# EAGLE design Telex-I (EAGLE 7.5.0)
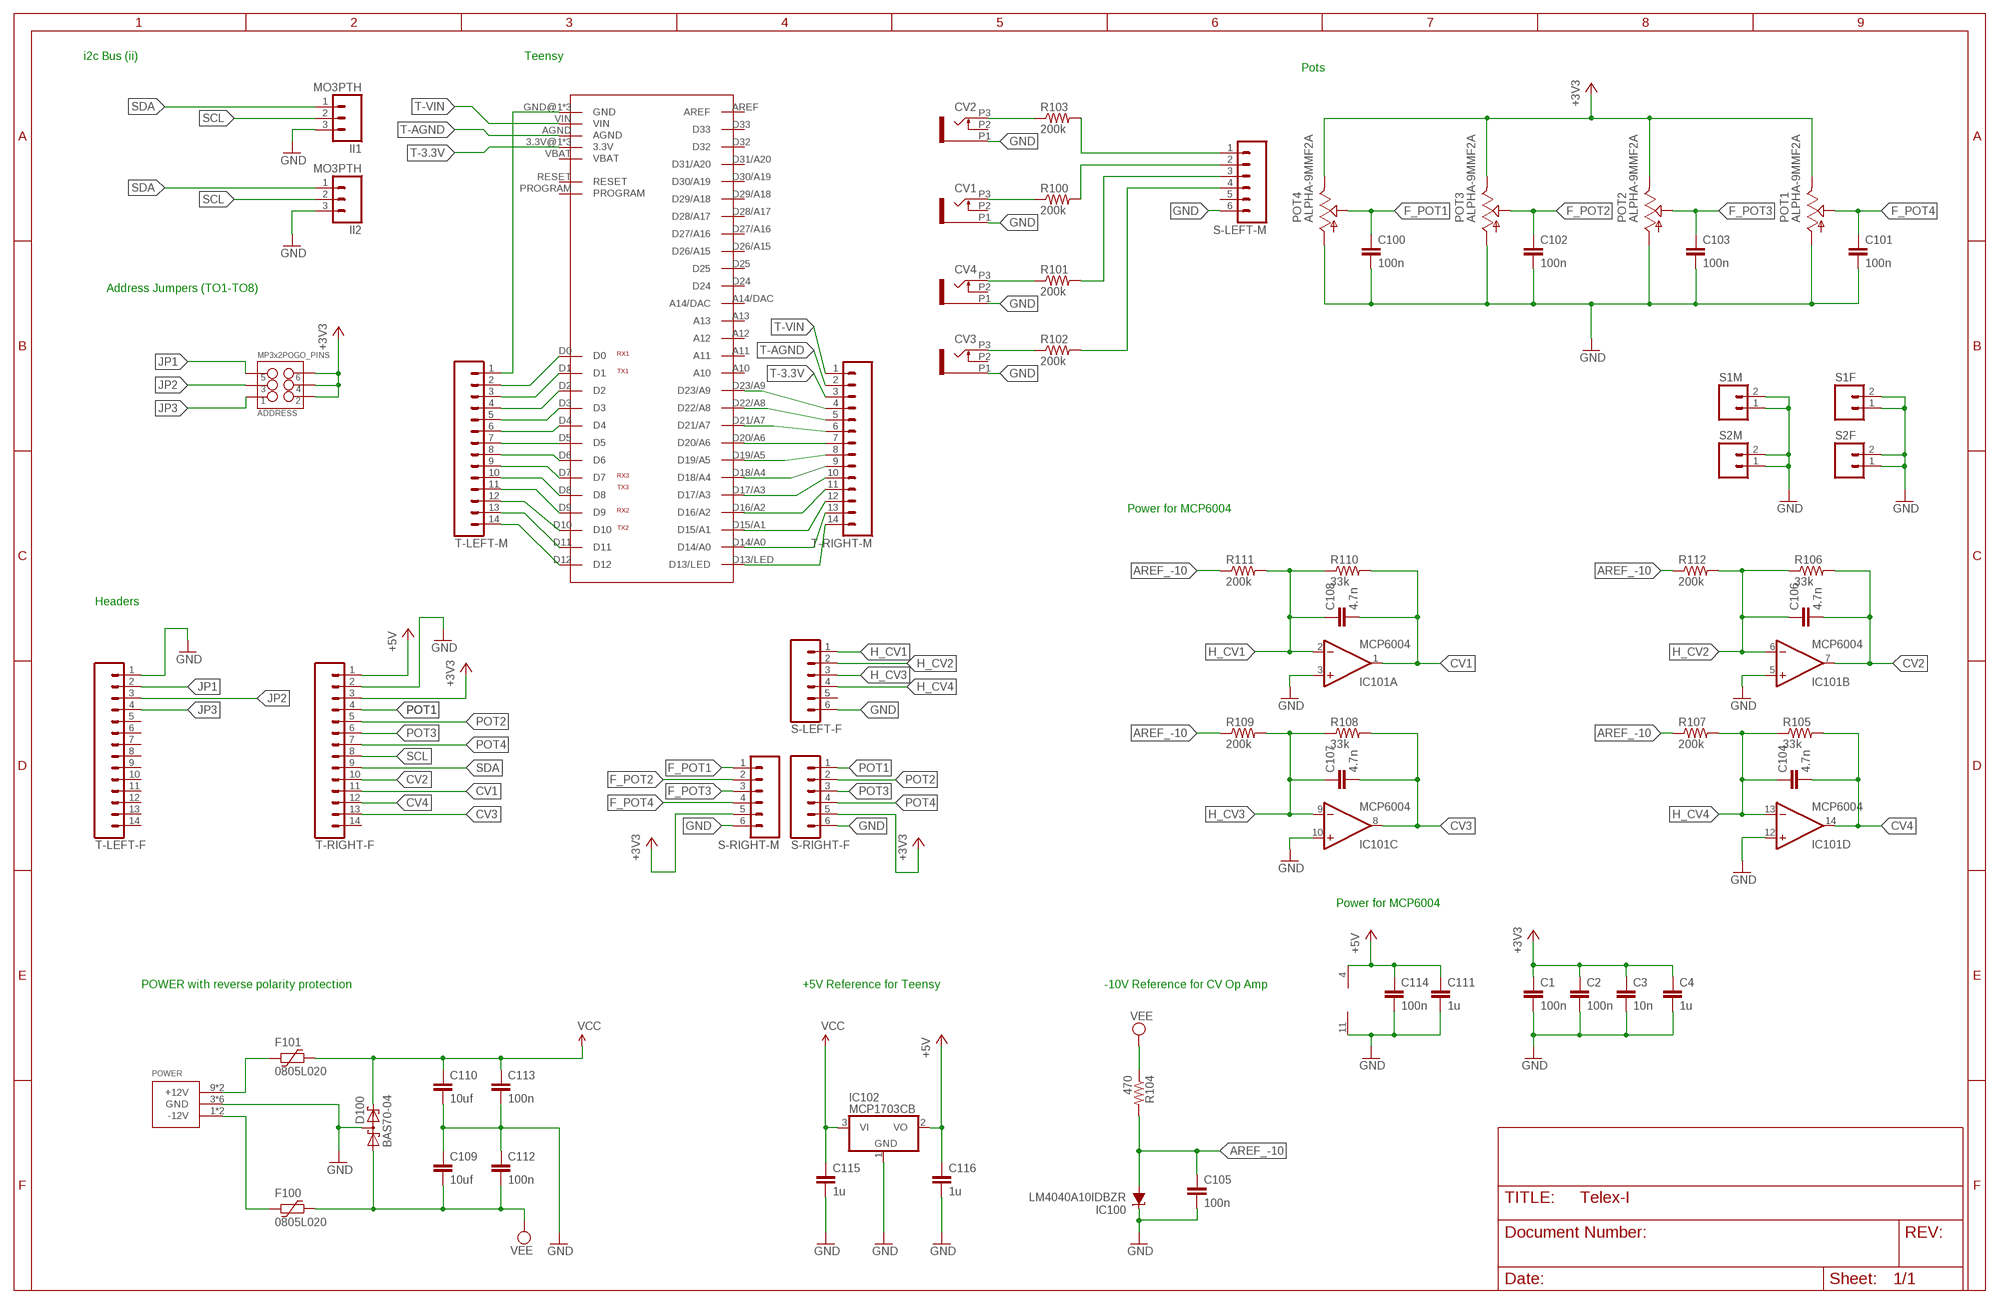
[diagram p0: schematic, sheet 1]

## Parts
ADDRESS  MP3x2POGO_PINS  M03X2POGO_PINS  [2X3_POGO]
C1  100n  CAP0603-CAP  [0603-CAP]
C2  100n  CAP0603-CAP  [0603-CAP]
C3  10n  CAP0603-CAP  [0603-CAP]
C4  1u  CAP0603-CAP  [0603-CAP]
C100  100n  CAP0603-CAP  [0603-CAP]
C101  100n  CAP0603-CAP  [0603-CAP]
C102  100n  CAP0603-CAP  [0603-CAP]
C103  100n  CAP0603-CAP  [0603-CAP]
C104  4.7n  CAP0603-CAP  [0603-CAP]
C105  100n  CAP0603-CAP  [0603-CAP]
C106  4.7n  CAP0603-CAP  [0603-CAP]
C107  4.7n  CAP0603-CAP  [0603-CAP]
C108  4.7n  CAP0603-CAP  [0603-CAP]
C109  10uf  CAP1206  [1206]
C110  10uf  CAP1206  [1206]
C111  1u  CAP0603-CAP  [0603-CAP]
C112  100n  CAP0603-CAP  [0603-CAP]
C113  100n  CAP0603-CAP  [0603-CAP]
C114  100n  CAP0603-CAP  [0603-CAP]
C115  1u  CAP0603-CAP  [0603-CAP]
C116  1u  CAP0603-CAP  [0603-CAP]
CV1  EURO_JACKS-7  [WQP_PJ_301M]
CV2  EURO_JACKS-7  [WQP_PJ_301M]
CV3  EURO_JACKS-7  [WQP_PJ_301M]
CV4  EURO_JACKS-7  [WQP_PJ_301M]
D100  BAS70-04  [SOT23]
F100  0805L020  [0805L]
F101  0805L020  [0805L]
IC100  LM4040A10IDBZR  LM4041A12DBZ  [DBZ_R-PDSO-G3]
IC101  MCP6004  TL074D  [SO14]
IC102  MCP1703CB  [SOT23]
II1  MO3PTH  M03PTH  [1X03]
II2  MO3PTH  M03PTH  [1X03]
POT1  ALPHA-9MMF2A  [EVUF]
POT2  ALPHA-9MMF2A  [EVUF]
POT3  ALPHA-9MMF2A  [EVUF]
POT4  ALPHA-9MMF2A  [EVUF]
POWER  10-Pin  POWER_SIMPLE10  [POWER_10]
R100  200k  R-US_R0603  [R0603]
R101  200k  R-US_R0603  [R0603]
R102  200k  R-US_R0603  [R0603]
R103  200k  R-US_R0603  [R0603]
R104  470  R-US_R0603  [R0603]
R105  33k  R-US_R0603  [R0603]
R106  33k  R-US_R0603  [R0603]
R107  200k  R-US_R0603  [R0603]
R108  33k  R-US_R0603  [R0603]
R109  200k  R-US_R0603  [R0603]
R110  33k  R-US_R0603  [R0603]
R111  200k  R-US_R0603  [R0603]
R112  200k  R-US_R0603  [R0603]
S1F  M02PTH  [1X02]
S1M  M02PTH  [1X02]
S2F  M02PTH  [1X02]
S2M  M02PTH  [1X02]
S-LEFT-F  M06SILK_FEMALE_PTH  [1X06]
S-LEFT-M  M06SILK_FEMALE_PTH  [1X06]
S-RIGHT-F  M06SILK_FEMALE_PTH  [1X06]
S-RIGHT-M  M06SILK_FEMALE_PTH  [1X06]
T-LEFT-F  M14  [1X14]
T-LEFT-M  M14  [1X14]
T-RIGHT-F  M14  [1X14]
T-RIGHT-M  M14  [1X14]
U$1  TEENSY3.1_ALL  [TEENSY3.1_ALL]

## Nets
+3V3: ADDRESS.P$2 ADDRESS.P$4 ADDRESS.P$6 C1.1 C2.1 C3.1 C4.1 POT1.3(E) POT2.3(E) POT3.3(E) POT4.3(E) S-RIGHT-F.5 S-RIGHT-M.5 T-RIGHT-F.3
+5V: C111.1 C114.1 C116.1 IC101.4(P:V+) IC102.2(VO) T-RIGHT-F.1
AREF_-10: C105.1 IC100.2(A) R104.2 R107.1 R109.1 R111.1 R112.1
CV1: C108.2 IC101.1(A:OUT) R110.2 T-RIGHT-F.11
CV2: C106.2 IC101.7(B:OUT) R106.2 T-RIGHT-F.10
CV3: C107.2 IC101.8(C:OUT) R108.2 T-RIGHT-F.13
CV4: C104.2 IC101.14(D:OUT) R105.2 T-RIGHT-F.12
F_POT1: C100.1 POT4.2(S) S-RIGHT-M.1
F_POT2: C102.1 POT3.2(S) S-RIGHT-M.2
F_POT3: C103.1 POT2.2(S) S-RIGHT-M.3
F_POT4: C101.1 POT1.2(S) S-RIGHT-M.4
GND: C1.2 C2.2 C3.2 C4.2 C100.2 C101.2 C102.2 C103.2 C105.2 C109.1 C110.2 C111.2 C112.1 C113.2 C114.2 C115.2 C116.2 CV1.P1 CV2.P1 CV3.P1 CV4.P1 D100.3(C1A2) IC100.1(C) IC101.3(A:+IN) IC101.5(B:+IN) IC101.10(C:+IN) IC101.11(P:V-) IC101.12(D:+IN) IC102.1(GND) II1.3 II2.3 POT1.1(A) POT2.1(A) POT3.1(A) POT4.1(A) POWER.3(GND) POWER.4(GND) POWER.5(GND) POWER.6(GND) POWER.7(GND) POWER.8(GND) S1F.1 S1F.2 S1M.1 S1M.2 S2F.1 S2F.2 S2M.1 S2M.2 S-LEFT-F.6 S-LEFT-M.6 S-RIGHT-F.6 S-RIGHT-M.6 T-LEFT-F.1 T-RIGHT-F.2
H_CV1: C108.1 IC101.2(A:-IN) R110.1 R111.2 S-LEFT-F.1
H_CV2: C106.1 IC101.6(B:-IN) R106.1 R112.2 S-LEFT-F.2
H_CV3: C107.1 IC101.9(C:-IN) R108.1 R109.2 S-LEFT-F.3
H_CV4: C104.1 IC101.13(D:-IN) R105.1 R107.2 S-LEFT-F.4
JP1: ADDRESS.P$5 T-LEFT-F.2
JP2: ADDRESS.P$3 T-LEFT-F.3
JP3: ADDRESS.P$1 T-LEFT-F.4
N$1: T-RIGHT-M.14 U$1.D13/LED
N$2: F101.2 POWER.9(+12V) POWER.10(+12V)
N$3: F100.2 POWER.1(-12V) POWER.2(-12V)
N$5: CV2.P3 R103.1
N$6: CV1.P3 R100.1
N$8: R103.2 S-LEFT-M.1
N$9: R100.2 S-LEFT-M.2
N$10: R101.2 S-LEFT-M.3
N$11: CV4.P3 R101.1
N$13: R102.2 S-LEFT-M.4
N$16: T-LEFT-M.2 U$1.D0
N$17: CV3.P3 R102.1
N$48: T-LEFT-M.3 U$1.D1
N$49: T-LEFT-M.4 U$1.D2
N$50: T-LEFT-M.5 U$1.D3
N$51: T-LEFT-M.6 U$1.D4
N$52: T-LEFT-M.7 U$1.D5
N$53: T-LEFT-M.8 U$1.D6
N$54: T-LEFT-M.9 U$1.D7
N$55: T-LEFT-M.12 U$1.D10
N$56: T-LEFT-M.13 U$1.D11
N$57: T-LEFT-M.1 U$1.GND@1(GND) U$1.GND@2(GND) U$1.GND@3(GND)
N$58: T-LEFT-M.10 U$1.D8
N$59: T-LEFT-M.11 U$1.D9
N$60: T-LEFT-M.14 U$1.D12
N$61: T-RIGHT-M.13 U$1.D14/A0
N$62: T-RIGHT-M.12
N$63: T-RIGHT-M.11
N$64: T-RIGHT-M.10
N$65: T-RIGHT-M.9
N$66: T-RIGHT-M.8 U$1.D19/A5
N$67: T-RIGHT-M.7
N$68: T-RIGHT-M.6
N$69: T-RIGHT-M.5 U$1.D22/A8
N$70: T-RIGHT-M.4 U$1.D23/A9
POT1: S-RIGHT-F.1 T-RIGHT-F.4
POT2: S-RIGHT-F.2 T-RIGHT-F.5
POT3: S-RIGHT-F.3 T-RIGHT-F.6
POT4: S-RIGHT-F.4 T-RIGHT-F.7
SCL: II1.2 II2.2 T-RIGHT-F.8
SDA: II1.1 II2.1 T-RIGHT-F.9
T-3.3V: T-RIGHT-M.3 U$1.3.3V@1(3.3V) U$1.3.3V@2(3.3V) U$1.3.3V@3(3.3V)
T-AGND: T-RIGHT-M.2 U$1.AGND
T-VIN: T-RIGHT-M.1 U$1.VIN
VCC: C110.1 C113.1 C115.1 D100.2(C2) F101.1 IC102.3(VI)
VEE: C109.2 C112.2 D100.1(A1) F100.1 R104.1
Unconnected: CV1.P2 CV2.P2 CV3.P2 CV4.P2 S-LEFT-F.5 S-LEFT-M.5 T-LEFT-F.5 T-LEFT-F.6 T-LEFT-F.7 T-LEFT-F.8 T-LEFT-F.9 T-LEFT-F.10 T-LEFT-F.11 T-LEFT-F.12 T-LEFT-F.13 T-LEFT-F.14 T-RIGHT-F.14 U$1.A10 U$1.A11 U$1.A12 U$1.A13 U$1.A14/DAC U$1.AREF U$1.D15/A1 U$1.D16/A2 U$1.D17/A3 U$1.D18/A4 U$1.D20/A6 U$1.D21/A7 U$1.D24 U$1.D25 U$1.D26/A15 U$1.D27/A16 U$1.D28/A17 U$1.D29/A18 U$1.D30/A19 U$1.D31/A20 U$1.D32 U$1.D33 U$1.PROGRAM U$1.RESET U$1.VBAT

## Notes on the sheet
- i2c Bus (ii) | Teensy
- Pots
- Address Jumpers (TO1-TO8)
- Power for MCP6004
- Headers
- Power for MCP6004
- POWER with reverse polarity protection | +5V Reference for Teensy | -10V Reference for CV Op Amp

## Library data of the parts
ADDRESS = SparkFun-Connectors:M03X2: 2x3 .1" header. Shrouded, with keying- CONN-10681 SMT- CONN-11415 Pogo pins- HW-11044; PROD_ID: HW-11044
C1-C4 C100-C116 = SparkFun-Passives:CAP: Capacitor Standard 0603 ceramic capacitor, and 0.1" leaded capacitor.
CV1-CV4 = tsyklon-labs:EURO_JACKS
D100 = diode:BAS70-04: Silicon Schottky Diodes General-purpose diode for high-speed switching
F100 F101 = polyfuse-smd_10:?: Polyfuse Resettable PTC Source: http://www.littelfuse.com/products/resettable-ptcs.aspx; MF: Littelfuse; MPN: 0805L020; OC_FARNELL: 1832107; OC_NEWARK: 05M2226
IC100 = texas:LM4041: PRECISION MICROPOWER SHUNT VOLTAGE REFERENCE Source: http://focus.ti.com/lit/ds/slcs146e/slcs146e.pdf; MPN: LM4041A12IDBZR; OC_FARNELL: 1407949; OC_NEWARK: 58K5875
IC101 = linear:TL074: OP AMP
IC102 = linear:MCP1703: 250 mA, 16V, Low Quiescent Current LDO Regulator Source: http://ww1.microchip.com/downloads/en/DeviceDoc/22049b.pdf
II1 II2 = SparkFun-Connectors:M03: Header 3 Standard 3-pin 0.1" header. Use with straight break away headers (SKU : PRT-00116), right angle break away headers (PRT-00553), swiss pins (PRT-00743), machine pins (PRT-00117), and female headers (PRT-00115). Molex polarized connector foot print use with SKU : PRT-08232 with associated crimp pins and housings.
POT1-POT4 = TomW:ALPHA-9MM: 9 mm Square Rotary Potentiometers Source: Panasonic
POWER = eurorack:POWER_SIMPLE
R100-R112 = adafruit:R-US_: RESISTOR, American symbol
S1F S1M S2F S2M = SparkFun-Connectors:M02: Standard 2-pin 0.1" header. Use with - straight break away headers ( PRT-00116) - right angle break away headers (PRT-00553) - swiss pins (PRT-00743) - machine pins (PRT-00117) - female headers (PRT-00115) Molex polarized connector foot print use with: PRT-08233 with associated crimp pins and housings. 2.54_SCREWTERM for use with PRT-10571. 3.5mm Screw Terminal footprints for PRT-08084 5mm Screw Terminal footprints for use with PRT-08432
S-LEFT-F S-LEFT-M S-RIGHT-F S-RIGHT-M = SparkFun-Connectors:M06: Header 6 Standard 6-pin 0.1" header. Use with straight break away headers (SKU : PRT-00116), right angle break away headers (PRT-00553), swiss pins (PRT-00743), machine pins (PRT-00117), and female headers (PRT-00115). Molex polarized connector foot print use with SKU : PRT-08094 with associated crimp pins and housings. NOTES ON THE VARIANTS LOCK and LOCK_LONGPADS... This footprint was designed to help hold the alignment of a through-hole component (i.e. 6-pin header) while soldering it into place. You may notice that each hole has been shifted either up or down by 0.005 of an inch from it's more standard position (which is a perfectly straight line). This slight alteration caused the pins (the squares in the middle) to touch the edges of the holes. Because they are alternating, it causes a "brace" to hold the component in place. 0.005 has proven to be the perfect amount of "off-center" position when using our standard breakaway headers. Although looks a little odd when you look at the bare footprint, once you have a header in there, the alteration is very hard to notice. Also,if you push a header all the way into place, it is covered up entirely on the bottom side. This idea of altering the position of holes to aid alignment will be further integrated into the Sparkfun Library for other footprints. It can help hold any component with 3 or more connection pins.; PROD_ID: CONN-08437
T-LEFT-F T-LEFT-M T-RIGHT-F T-RIGHT-M = SparkFun-Connectors:M14: Header 14 Standard 14-pin 0.1" header. Use with straight break away headers (SKU : PRT-00116), right angle break away headers (PRT-00553), swiss pins (PRT-00743), machine pins (PRT-00117), and female headers (PRT-00115).
U$1 = Teensy3.1:TEENSY3.1_ALL

## Net classes
0 default: width 0.254 mm, drill 0.508 mm, clearance 0.203 mm

## Board
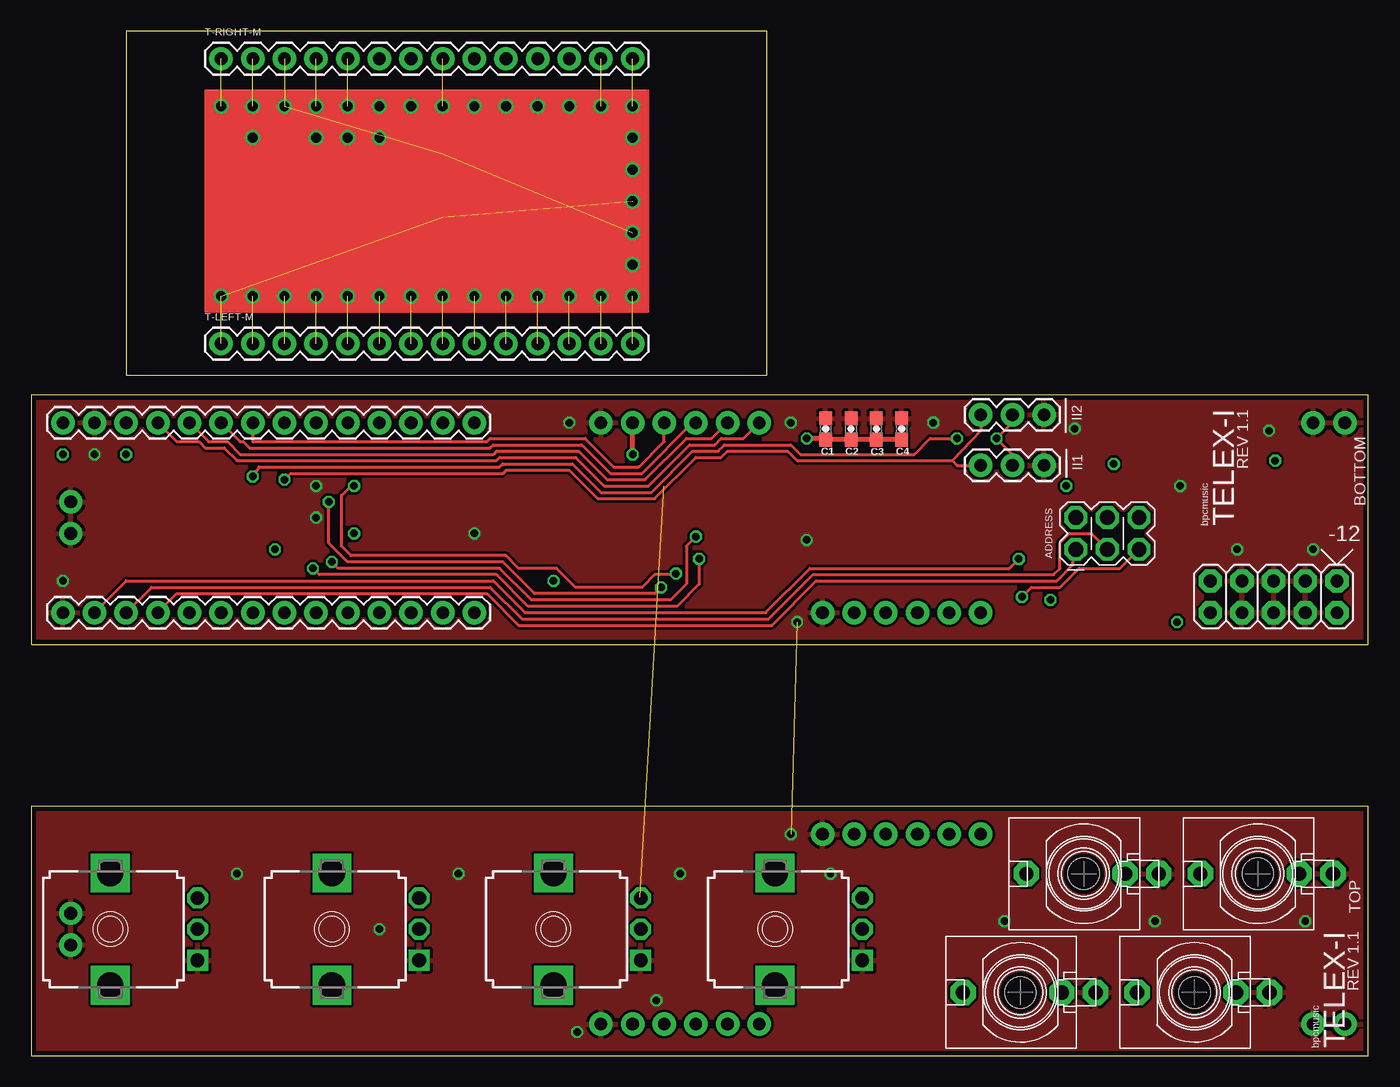
[diagram p1: board, top side]
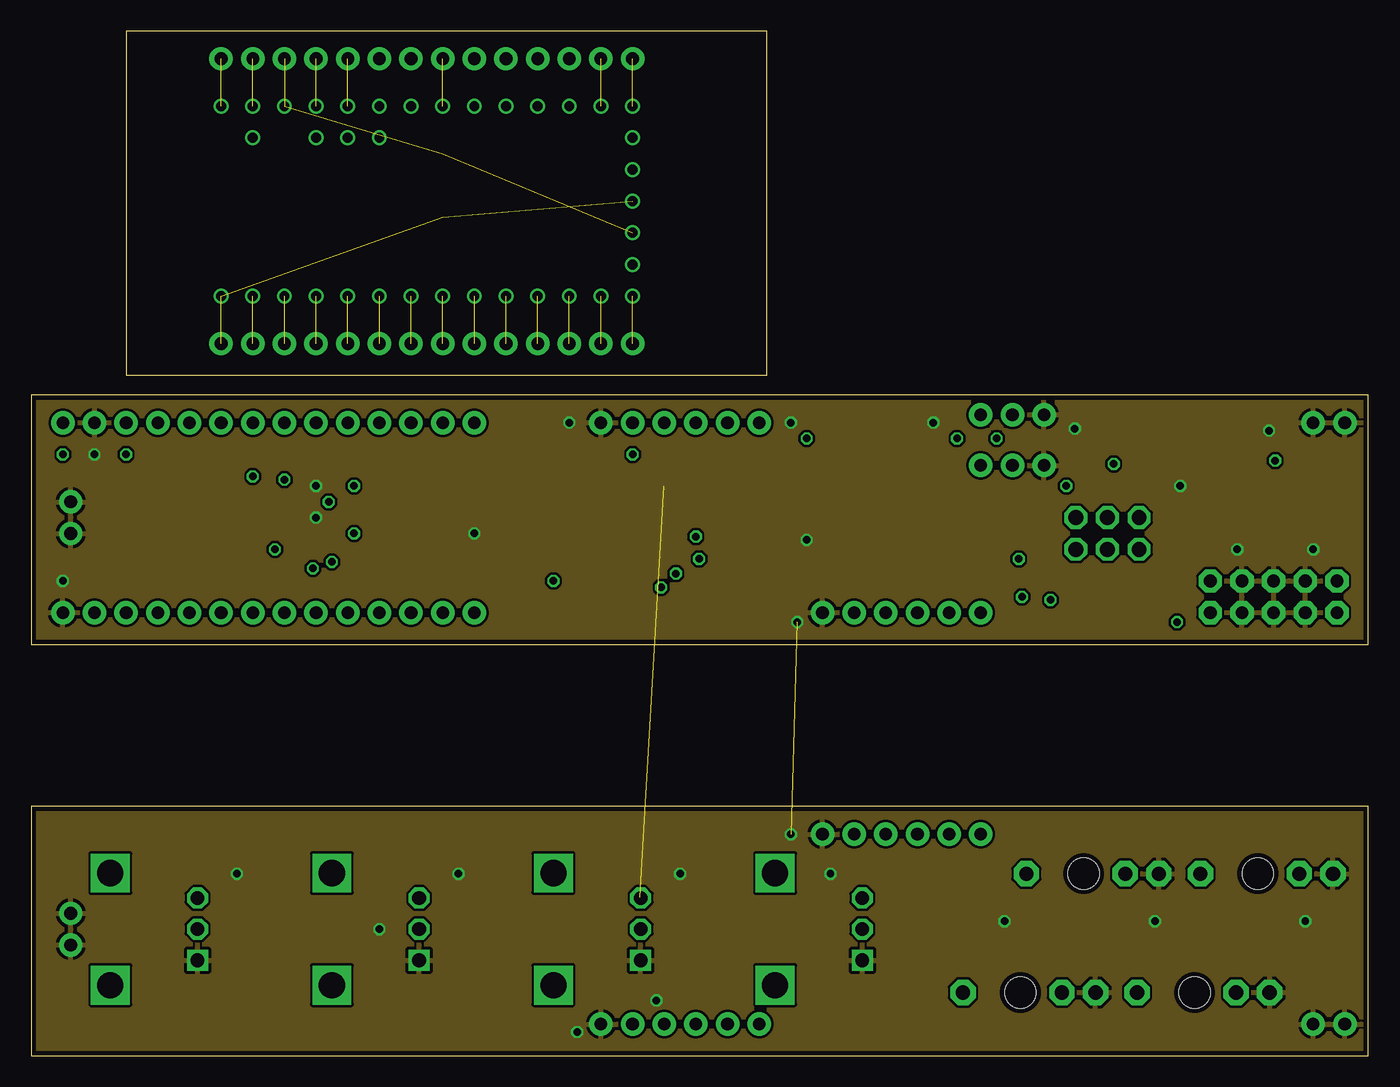
[diagram p2: board, inner layer Route2]
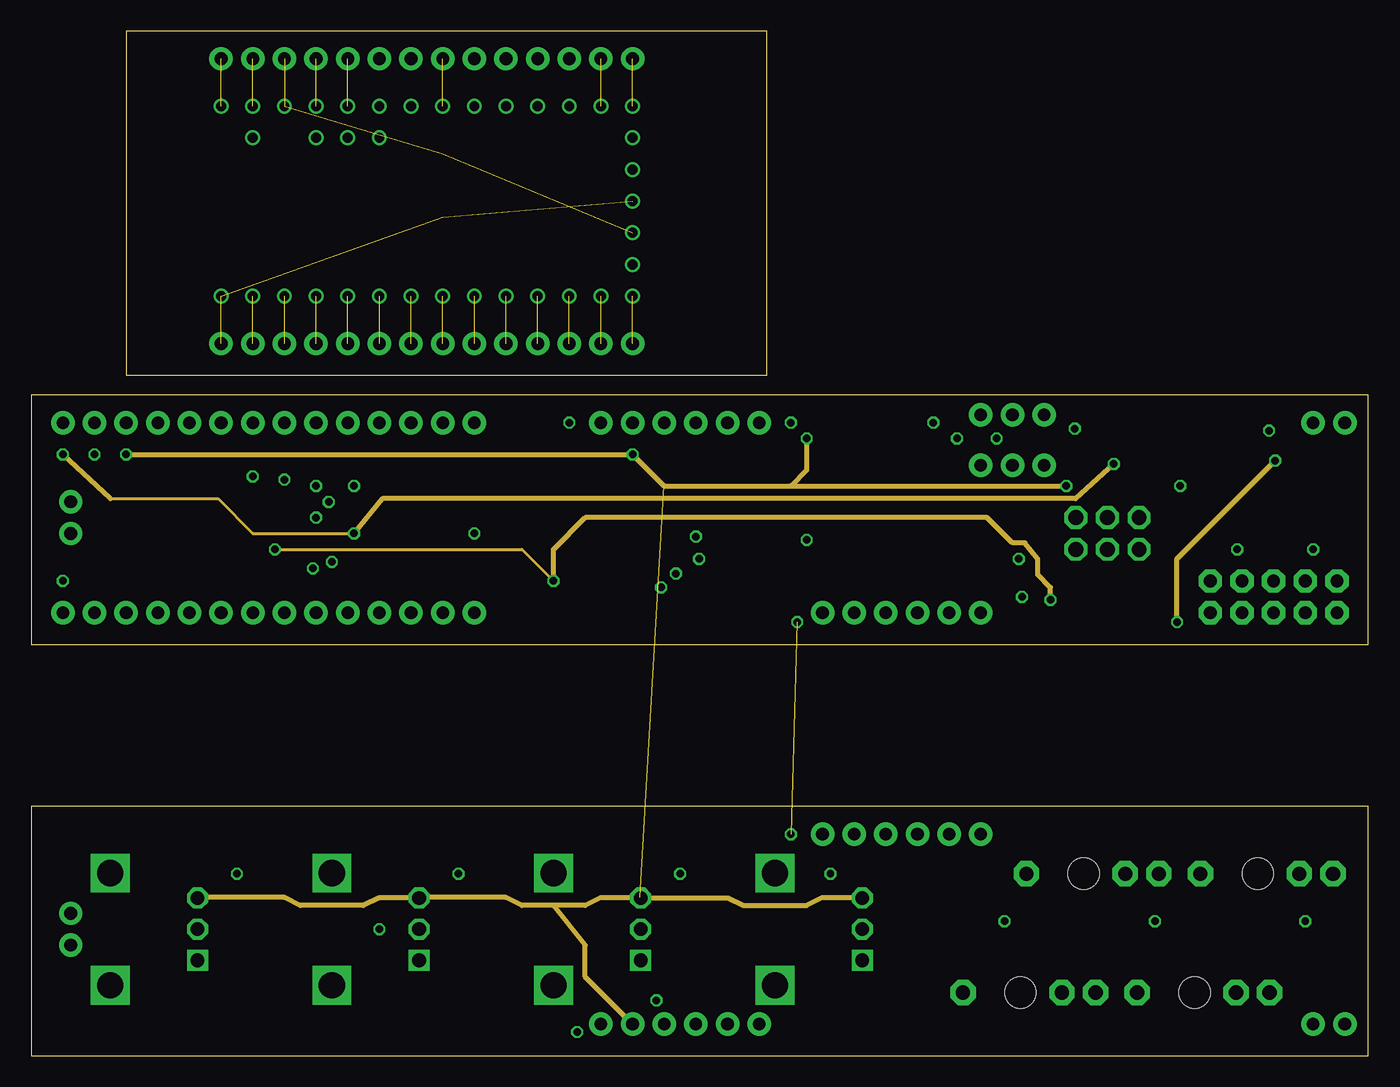
[diagram p3: board, inner layer Route15]
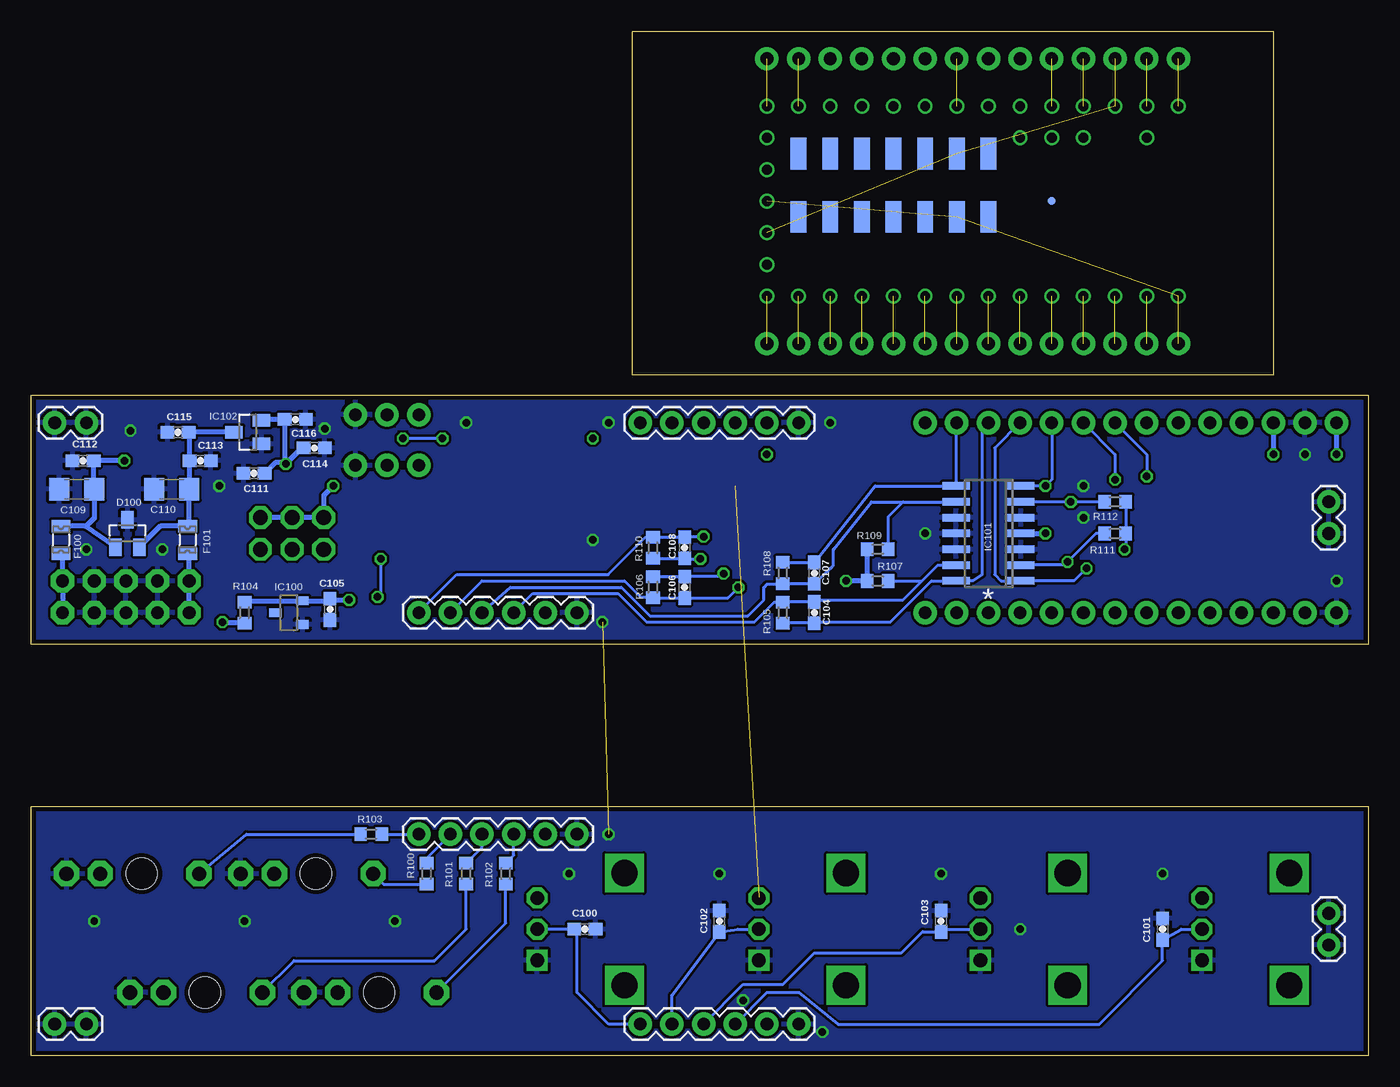
[diagram p4: board, bottom side, seen from below]

Size 107.3 x 82.22 mm. Coordinates in mm from the lower left corner, seen from the top.
Outline: 0,0 107.3,0 107.3,19.99 0,19.99 0,0
Outline: 107.3,53.01 0,53.01 0,33.02 107.3,33.02 107.3,53.01
Outline: 59.03,82.22 7.62,82.22 7.62,54.61 59.03,54.61 59.03,82.22
Copper layers (1*16): Top 0.0356mm / dielectric 1.5011mm / Bottom 0.0356mm
Design rules "LaenPCBOrder": minimum track width 6mil, minimum drill 13mil, track to track 6mil, track to pad 6mil, pad to pad 6mil, via to via 6mil, smd to smd 6mil, copper to edge 15mil, drill to drill 6mil, minimum pad ring 7mil, minimum via ring 7mil, stop-mask expansion 3mil, vias tented up to drill 0mil, thermal gap 10mil

### Footprints (pad centres in the part's own frame; a part is rotated, then mirrored left to right if it is on the bottom)
2X3_POGO = drill 1.2 pad 1.829 octagon: P$1 0,0; P$2 0,2.54; P$3 2.54,0; P$4 2.54,2.54; P$5 5.08,0; P$6 5.08,2.54
0603-CAP = smd 1.1 x 1: 1 -0.85,0; 2 0.85,0
1206 = smd 1.6 x 1.8: 1 -1.4,0; 2 1.4,0
WQP_PJ_301M = drill 1.143 pad 2.032 octagon: P1 0,-6.032; P2 0,-3.334; P3 0,4.604 | hole 2.5: 0,0
SOT23 = smd 1 x 1.4: 1 -0.95,-1.1; 2 0.95,-1.1; 3 0,1.1
0805L = smd 1 x 1.5: 1 -1.1,0; 2 1.1,0
DBZ_R-PDSO-G3 = smd 0.7 x 1: 1 -0.95,-1.1; 2 0.95,-1.1; 3 0,1.1
SO14 = smd 0.6 x 2.2: 1 -3.81,-2.6; 2 -2.54,-2.6; 3 -1.27,-2.6; 4 0,-2.6; 5 1.27,-2.6; 6 2.54,-2.6; 7 3.81,-2.6; 8 3.81,2.6; 9 2.54,2.6; 10 1.27,2.6; 11 0,2.6; 12 -1.27,2.6; 13 -2.54,2.6; 14 -3.81,2.6
1X03 = drill 1.016 pad 1.88: 1 0,0; 2 2.54,0; 3 5.08,0
EVUF = drill 1.1 pad 1.676 square: 1 -2.5,-7 | drill 1.1 pad 1.676 octagon: 2 0,-7; 3 2.5,-7 | drill 2.1 pad 2.8 square: M1 4.5,0; M2 -4.5,0
POWER_10 = drill 1.016 pad 1.88 octagon: 1 -5.08,-1.27; 2 -5.08,1.27; 3 -2.54,-1.27; 4 -2.54,1.27; 5 0,-1.27; 6 0,1.27; 7 2.54,-1.27; 8 2.54,1.27; 9 5.08,-1.27; 10 5.08,1.27
R0603 = smd 1 x 1.1: 1 -0.85,0; 2 0.85,0
1X02 = drill 1.016 pad 1.88: 1 0,0; 2 2.54,0
1X06 = drill 1.016 pad 1.88: 1 0,0; 2 2.54,0; 3 5.08,0; 4 7.62,0; 5 10.16,0; 6 12.7,0
1X14 = drill 1.016 pad 1.88: 1 0,0; 2 2.54,0; 3 5.08,0; 4 7.62,0; 5 10.16,0; 6 12.7,0; 7 15.24,0; 8 17.78,0; 9 20.32,0; 10 22.86,0; 11 25.4,0; 12 27.94,0; 13 30.48,0; 14 33.02,0
TEENSY3.1_ALL = drill 0.8: 3.3V@1 2.54,5.08; 3.3V@2 -7.62,-22.86; A10 0,0; A11 0,-2.54; A14/DAC 0,-22.86; AGND 2.54,7.62; AREF 0,2.54; D0 -12.7,7.62; D1 -12.7,5.08; D2 -12.7,2.54; D3 -12.7,0; D4 -12.7,-2.54; D5 -12.7,-5.08; D6 -12.7,-7.62; D7 -12.7,-10.16; D8 -12.7,-12.7; D9 -12.7,-15.24; D10 -12.7,-17.78; D11 -12.7,-20.32; D12 -12.7,-22.86; D13/LED 2.54,-22.86; D14/A0 2.54,-20.32; D15/A1 2.54,-17.78; D16/A2 2.54,-15.24; D17/A3 2.54,-12.7; D18/A4 2.54,-10.16; D19/A5 2.54,-7.62; D20/A6 2.54,-5.08; D21/A7 2.54,-2.54; D22/A8 2.54,0; D23/A9 2.54,2.54; GND@1 -12.7,10.16; GND@2 -5.08,-22.86; PROGRAM -2.54,-22.86; VBAT -10.16,-22.86; VIN 2.54,10.16; VUSB 0,7.62 | smd 2.54 x 1.27 bottom: 3.3V@3 -1.27,-7.62; A12 -6.35,-5.08; A13 -1.27,-5.08; D24 -6.35,-10.16; D25 -6.35,-12.7; D26/A15 -6.35,-15.24; D27/A16 -6.35,-17.78; D28/A17 -6.35,-20.32; D29/A18 -1.27,-20.32; D30/A19 -1.27,-17.78; D31/A20 -1.27,-15.24; D32 -1.27,-12.7; D33 -1.27,-10.16; GND@3 -6.35,-7.62 | smd 0.635 x 0.635 bottom: RESET -5.08,0

### Placement (x,y rotation side)
ADDRESS  83.82,40.64 0 top
C1  63.75,50.29 90 top
C2  65.79,50.29 90 top
C3  67.82,50.29 90 top
C4  69.85,50.29 90 top
C100  62.87,10.16 0 bottom
C101  16.51,10.16 90 bottom
C102  52.07,10.79 90 bottom
C103  34.29,10.79 90 bottom
C104  44.45,35.56 270 bottom
C105  83.31,35.81 270 bottom
C106  54.86,37.59 90 bottom
C107  44.45,38.73 90 bottom
C108  54.86,40.77 270 bottom
C109  103.63,45.47 0 bottom
C110  96.01,45.47 180 bottom
C111  89.41,46.74 180 bottom
C112  103.12,47.75 0 bottom
C113  93.73,47.75 0 bottom
C114  84.58,48.77 0 bottom
C115  95.5,50.04 180 bottom
C116  86.11,51.05 0 bottom
CV1  84.45,14.61 90 top
CV2  98.42,14.61 90 top
CV3  79.38,5.08 90 top
CV4  93.34,5.08 90 top
D100  99.57,41.91 0 bottom
F100  104.9,41.4 270 bottom
F101  94.74,41.4 270 bottom
IC100  86.61,35.56 90 bottom
IC101  30.48,41.91 90 bottom
IC102  89.92,50.04 90 bottom
II1  76.2,47.37 0 top
II2  76.2,51.44 0 top
POT1  6.35,10.16 90 top
POT2  24.13,10.16 90 top
POT3  41.91,10.16 90 top
POT4  59.69,10.16 90 top
POWER  99.69,36.83 180 top
R100  75.56,14.61 90 bottom
R101  72.39,14.61 90 bottom
R102  69.22,14.61 90 bottom
R103  80.01,17.78 0 bottom
R104  90.17,35.56 90 bottom
R105  46.99,35.56 270 bottom
R106  57.4,37.59 90 bottom
R107  39.37,38.1 0 bottom
R108  46.99,38.73 90 bottom
R109  39.37,40.64 0 bottom
R110  57.4,40.77 270 bottom
R111  20.32,41.91 180 bottom
R112  20.32,44.45 180 bottom
S1F  3.17,8.89 90 bottom
S1M  3.17,41.91 90 bottom
S2F  105.41,2.54 0 bottom
S2M  105.41,50.8 0 bottom
S-LEFT-F  76.2,35.56 0 bottom
S-LEFT-M  76.2,17.78 0 bottom
S-RIGHT-F  58.42,50.8 0 bottom
S-RIGHT-M  58.42,2.54 0 bottom
T-LEFT-F  2.54,35.56 0 top
T-LEFT-M  15.24,57.15 0 top
T-RIGHT-F  2.54,50.8 0 top
T-RIGHT-M  15.24,80.01 0 top
U$1  25.4,73.66 90 top

### Tracks (layer width: path | path; a pad name or v marks a point on that pad's centre or on a via)
+3V3  (via drill 0.6)  (1 unrouted)
  Top 0.406: v48.26,48.26 S-RIGHT-F.5 | C4.1 C3.1 C2.1 C1.1 63.41,49.53 v62.23,49.53
  Route15 0.406: S-RIGHT-M.5 44.45,6.35 44.45,8.89 41.91,12.06 | 41.91,12.06 44.45,12.06 45.72,12.7 48.87,12.7 POT3.3 55.92,12.66 57.15,12.06 62.23,12.06 63.5,12.7 66.65,12.7 POT4.3 | 41.91,12.06 39.37,12.06 38.1,12.7 31.17,12.7 POT2.3 27.9,12.66 26.67,12.06 21.59,12.06 20.32,12.7 13.39,12.7 POT1.3 | v7.62,48.26 v48.26,48.26 50.8,45.72 60.96,45.72 | 60.96,45.72 v83.06,45.72 | v62.23,49.53 62.23,46.99 60.96,45.72
  Bottom 0.406: T-RIGHT-F.3 v7.62,48.26 | v83.06,45.72 83.82,44.96 ADDRESS.P$2 ADDRESS.P$4 ADDRESS.P$6
+5V  (via drill 0.6)
  Route15 0.254: 6.35,44.7 14.99,44.7 17.78,41.91 v25.91,41.91
  Route15 0.406: v86.87,47.5 83.82,44.7 28.19,44.7 v25.91,41.91 | 6.35,44.7 v2.54,48.26
  Bottom 0.406: IC102.2 88.75,51.05 C116.1 86.96,47.59 | 86.96,47.59 v86.87,47.5 85.6,48.77 C114.1 | v2.54,48.26 T-RIGHT-F.1 | 86.96,47.59 87.71,47.59 C111.1 | IC101.4 v25.91,41.91
AREF_-10  (via drill 0.6)
  Route15 0.254: v19.56,40.64 39.37,40.64 v41.91,38.1
  Route15 0.406: v81.79,36.58 81.79,37.59 80.77,38.61 80.77,39.88 79.76,41.15 78.74,41.15 76.71,43.18 44.45,43.18 41.91,40.64 v41.91,38.1
  Bottom 0.254: R112.1 R111.1 19.47,40.73 v19.56,40.64
  Bottom 0.406: R104.2 90.07,36.51 IC100.2 83.47,36.51 C105.1 83.06,36.58 v81.79,36.58 | v41.91,38.1 R107.1 R109.1
CV1  (via drill 0.6)
  Top 0.254: v53.59,39.88 53.59,37.85 51.82,36.07 39.88,36.07 37.34,38.61 23.11,38.61 v22.61,39.12
  Bottom 0.254: R110.2 C108.2 54.83,39.88 v53.59,39.88 | v22.61,39.12 23.62,38.1 IC101.1 29.46,38.1 29.97,38.61 29.97,48.77 T-RIGHT-F.11
CV2  (via drill 0.6)
  Top 0.254: v51.73,38.7 51.39,38.61 50.04,38.61 49.02,37.59 43.69,37.59 42.16,39.12 39.12,39.12 38.1,40.13 25.65,40.13 24.89,40.89 24.89,44.96 25.65,45.72 v25.91,45.72
  Bottom 0.254: R106.2 C106.2 51.98,38.44 v51.73,38.7 | IC101.7 v25.91,45.72 25.4,46.23 T-RIGHT-F.10
CV3
  Bottom 0.254: R108.2 C107.2 39.59,45.72 IC101.8 33.08,50.74 T-RIGHT-F.13
CV4
  Bottom 0.254: R105.2 C104.2 44.36,34.8 38.35,34.8 35.05,38.1 IC101.14 31.75,38.1 30.99,38.61 30.99,50.04 T-RIGHT-F.12
F_POT1
  Bottom 0.254: S-RIGHT-M.1 60.96,2.54 63.5,5.08 63.5,9.95 C100.1 POT4.2
F_POT2
  Bottom 0.254: S-RIGHT-M.2 55.88,4.87 C102.1 50.59,10.16 POT3.2
F_POT3
  Bottom 0.254: S-RIGHT-M.3 50.16,5.71 46.99,5.71 44.45,8.26 37.47,8.26 35.77,9.95 C103.1 | 34.08,10.16 POT2.2
  Bottom 0.406: 34.08,10.16 C103.1
F_POT4
  Bottom 0.254: S-RIGHT-M.4 48.26,5.08 45.72,5.08 42.55,2.54 21.59,2.54 16.51,7.62 C101.1 15.03,10.16 POT1.2
GND  (via drill 0.6)  (1 unrouted)
  other vias: 27.94,10.16 43.81,1.91 90.17,10.79 50.16,4.45 60.96,17.78 22.86,45.72 22.86,43.18 35.56,41.91 5.08,48.26 2.54,38.1 43.18,50.8 61.47,34.8 60.96,50.8 72.39,50.8 83.74,50.32 96.77,40.64 102.87,40.64 99.33,50.16 92.2,45.72 62.23,41.4 16.51,14.61 34.29,14.61 52.07,14.61 64.14,14.61 78.11,10.79 102.23,10.79
  pour Bottom: -1.27,21.59 109.22,21.59 109.22,-1.27 -1.27,-1.27
  pour Bottom: -1.27,54.61 109.22,54.61 109.22,31.75 -1.27,31.75
  pour Top: -1.27,21.59 109.22,21.59 109.22,-1.27 -1.27,-1.27
  pour Top: -1.27,54.61 109.22,54.61 109.22,31.75 -1.27,31.75
  pour Route2: -1.27,54.61 109.22,54.61 109.22,31.75 -1.27,31.75
  pour Route2: -1.27,21.59 109.22,21.59 109.22,-1.27 -1.27,-1.27
H_CV1  (via drill 0.6)
  Top 0.254: v53.34,41.66 52.58,40.89 52.58,37.85 51.31,36.58 40.13,36.58 37.59,39.12 24.64,39.12 v24.13,39.62
  Bottom 0.254: S-LEFT-F.1 73.15,38.61 61,38.61 57.99,41.62 R110.1 C108.1 54.83,41.66 v53.34,41.66 | IC101.2 24.38,39.37 v24.13,39.62 21.84,41.91 R111.2
H_CV2  (via drill 0.6)
  Top 0.254: v50.55,37.59 50.04,37.08 40.39,37.08 37.85,39.62 25.4,39.62 23.88,41.15 v23.88,44.45
  Bottom 0.254: S-LEFT-F.2 71.12,38.1 59.69,38.1 58.42,36.83 57.49,36.83 R106.1 C106.1 51.4,36.74 v50.55,37.59 | IC101.6 v23.88,44.45 R112.2
H_CV3
  Bottom 0.254: S-LEFT-F.3 68.83,37.59 59.94,37.59 57.66,35.31 49.78,35.31 48.51,36.58 48.51,37.59 48.26,37.85 47.03,37.85 R108.1 C107.1 44.23,38.1 43.18,39.12 42.93,39.37 42.93,40.64 39.88,44.45 37.34,44.45 | 37.34,44.45 IC101.9 | R109.2 38.52,43.27 37.34,44.45
H_CV4
  Bottom 0.254: S-LEFT-F.4 67.06,37.08 60.2,37.08 57.91,34.8 49.28,34.8 47.66,36.41 R105.1 C104.1 44.28,36.58 37.34,36.58 35.81,38.1 | 35.81,38.1 34.54,39.37 IC101.13 | R107.2 35.81,38.1
JP1  (via drill 0.6)
  Top 0.254: T-LEFT-F.2 7.62,38.1 37.08,38.1 39.62,35.56 58.93,35.56 62.48,39.12 78.49,39.12 v79.25,39.88 | v79.5,36.83 80.26,37.59 82.55,37.59 84.07,39.12 87.38,39.12 ADDRESS.P$5
  Bottom 0.254: v79.25,39.88 79.25,37.08 v79.5,36.83
JP2
  Top 0.254: T-LEFT-F.3 9.65,37.59 36.83,37.59 39.37,35.05 59.18,35.05 62.74,38.61 82.04,38.61 82.55,39.12 82.55,41.15 83.31,41.91 85.09,41.91 ADDRESS.P$3
JP3
  Top 0.254: T-LEFT-F.4 11.68,37.08 36.58,37.08 39.12,34.54 59.44,34.54 62.99,38.1 82.3,38.1 83.57,39.37 ADDRESS.P$1
N$1  (1 unrouted)
N$2
  Bottom 0.406: POWER.10 POWER.9 94.61,40.17 F101.2
N$3
  Bottom 0.406: POWER.2 POWER.1 104.78,40.17 F100.2
N$5
  Bottom 0.254: CV2.P3 90.01,17.78 R103.1
N$6
  Bottom 0.254: CV1.P3 79,13.76 R100.1
N$8
  Bottom 0.254: R103.2 S-LEFT-M.1
N$9
  Bottom 0.254: R100.2 75.98,15.46 S-LEFT-M.2
N$10
  Bottom 0.254: R101.2 71.12,16.73 S-LEFT-M.3
N$11
  Bottom 0.254: CV4.P3 86.2,7.62 74.93,7.62 72.39,10.16 R101.1
N$13
  Bottom 0.254: R102.2 68.58,16.09 S-LEFT-M.4
N$16  (1 unrouted)
N$17
  Bottom 0.254: CV3.P3 69.22,10.64 R102.1
N$48  (1 unrouted)
N$49  (1 unrouted)
N$50  (1 unrouted)
N$51  (1 unrouted)
N$52  (1 unrouted)
N$53  (1 unrouted)
N$54  (1 unrouted)
N$55  (1 unrouted)
N$56  (1 unrouted)
N$57  (3 unrouted)
N$58  (1 unrouted)
N$59  (1 unrouted)
N$60  (1 unrouted)
N$61  (1 unrouted)
N$66  (1 unrouted)
N$69  (1 unrouted)
N$70  (1 unrouted)
POT1
  Top 0.254: T-RIGHT-F.4 11.68,49.28 13.46,49.28 13.97,48.77 15.49,48.77 16.51,47.75 37.34,47.75 37.59,48.01 43.69,48.01 45.97,45.72 49.53,45.72 52.83,49.02 54.86,49.02 55.37,49.53 57.15,49.53 S-RIGHT-F.1
POT2
  Top 0.254: T-RIGHT-F.5 14.22,49.28 15.75,49.28 16.76,48.26 37.08,48.26 37.34,48.51 43.94,48.51 46.23,46.23 49.28,46.23 52.58,49.53 54.61,49.53 S-RIGHT-F.2
POT3
  Top 0.254: T-RIGHT-F.6 16.76,49.28 17.02,49.28 17.53,48.77 36.83,48.77 37.08,49.02 44.2,49.02 46.48,46.74 49.02,46.74 53.09,50.8 S-RIGHT-F.3
POT4
  Top 0.254: T-RIGHT-F.7 17.78,49.28 36.58,49.28 36.83,49.53 44.45,49.53 46.74,47.24 48.77,47.24 50.8,49.28 S-RIGHT-F.4
SCL  (via drill 0.6)
  Top 0.254: v17.78,46.48 18.29,47.24 37.59,47.24 37.85,47.5 43.43,47.5 45.72,45.21 49.78,45.21 53.09,48.51 55.12,48.51 55.63,49.02 60.96,49.02 61.72,48.26 70.87,48.26 72.14,49.53 v74.3,49.53 | II2.2 78.74,50.8 v77.47,49.53 78.74,48.26 II1.2
  Bottom 0.254: T-RIGHT-F.8 17.78,48.26 v17.78,46.48 | v74.3,49.53 v77.47,49.53
SDA  (via drill 0.6)
  Top 0.254: v20.32,46.23 20.83,46.74 37.85,46.74 38.1,46.99 43.18,46.99 45.47,44.7 50.04,44.7 53.34,48.01 55.37,48.01 55.88,48.51 60.71,48.51 61.47,47.75 73.94,47.75 | 73.94,47.75 74.3,47.37 II1.1 | II2.1 76.2,50.16 73.94,47.75
  Bottom 0.254: T-RIGHT-F.9 20.32,48.26 v20.32,46.23
T-3.3V  (3 unrouted)
T-AGND  (1 unrouted)
T-VIN  (1 unrouted)
VCC
  Bottom 0.406: D100.2 96.93,42.5 F101.1 94.61,42.63 C110.1 94.58,45.5 C113.1 94.58,49.96 C115.1 IC102.3
VEE  (via drill 0.6)
  Route15 0.406: v91.95,34.8 91.95,39.88 v99.82,47.75
  Bottom 0.406: D100.1 102.97,42.5 | 102.97,42.5 102.87,42.5 102.23,43.14 C109.2 102.27,45.51 C112.2 v99.82,47.75 | 102.97,42.5 F100.1 | R104.1 91.86,34.71 v91.95,34.8

### Text on the board
tPlace: __ | _ | _ | _
bPlace: *
tNames: REV 1.1 | BOTTOM | bpcmusic | TELEX-I | TOP | REV 1.1 | bpcmusic | TELEX-I